# Altium project RS232 Communicate To TTL.PrjPcb
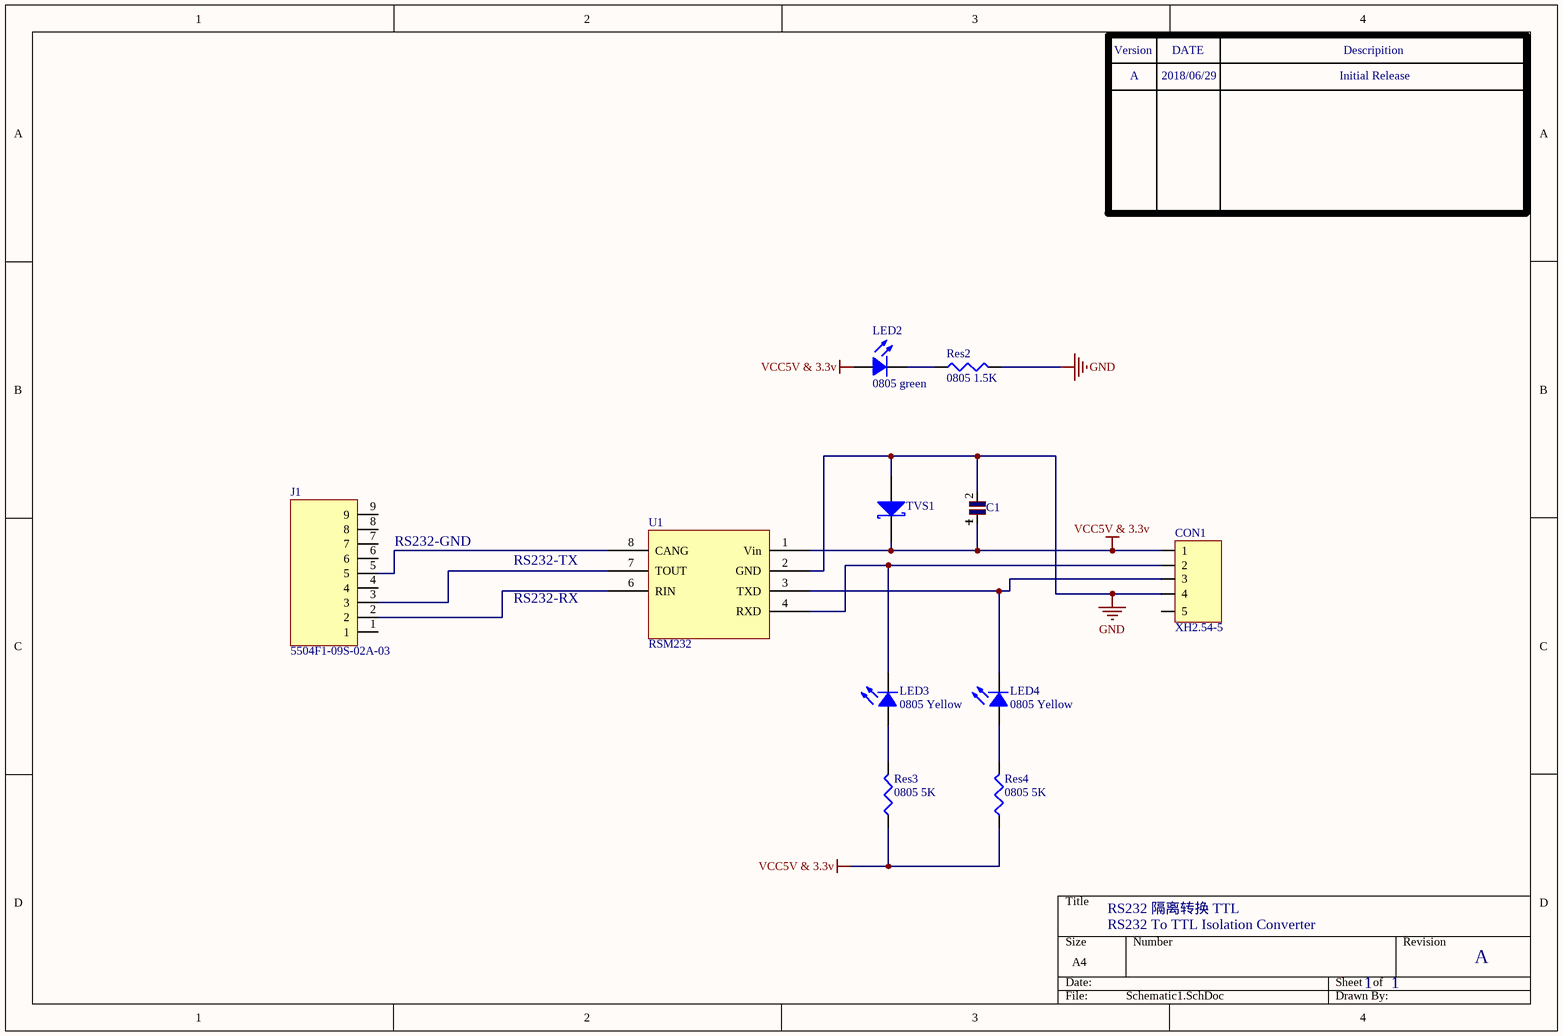
[diagram p0: Schematic1.SchDoc]
1 sheet, 11 parts. Net scope: global (net labels, ports and power ports of the same name join across sheets).
Board file: PCB1.PcbDoc

## Sheet Schematic1.SchDoc
size A4; Revision: A

### Parts
C1  T491C226K025AT  [T491C226K010AT]  (value not drawn)
CON1  XH2.54-5  [XH2.54-5]
J1  5504F1-09S-02A-03  [5504F1-09S-02A-03]
LED2  0805 green  [0805 LED]
LED3  0805 Yellow  [0805 LED]
LED4  0805 Yellow  [0805 LED]
Res2  0805 1.5K  [0805 Resistor]
Res3  0805 5K  [0805 Resistor]
Res4  0805 5K  [0805 Resistor]
TVS1  SMBJ5.0A  [SMBJ5.0A]  (value not drawn)
U1  RSM232  [RSM232]

### Nets
GND: C1.2 CON1.4 Res2.2 TVS1.1(A) U1.2(GND)
VCC5V & 3.3v: C1.1 CON1.1 LED2.1(A) Res3.1 Res4.1 TVS1.2(K) U1.1(Vin)
NetCON1_2: CON1.2 LED3.2(K) U1.4(RXD)
NetCON1_3: CON1.3 LED4.2(K) U1.3(TXD)
NetJ1_2: J1.2 U1.6(RIN)
NetJ1_3: J1.3 U1.7(TOUT)
NetJ1_5: J1.5 U1.8(CANG)
NetLED2_2: LED2.2(K) Res2.1
NetLED3_1: LED3.1(A) Res3.2
NetLED4_1: LED4.1(A) Res4.2

Not connected (* = marked no-connect by the designer): CON1 5; J1 1 4 6 7 8 9

### Notes on the sheet
- Version
- A
- 2018/06/29
- DATE
- Initial Release
- Descripition
- (near J1) RS232-GND
- RS232-TX
- RS232-RX
- RS232 隔离转换 TTL
- RS232 To TTL Isolation Converter
- 1

### Library data of the parts
C1 = T491C226K010AT: 表面贴装钽电容, 22 μF, 10 V, T491 系列, ± 10%, 2312 [6032 公
J1 = 5504F1-09S-02A-03: D-Sub 连接器, 9 触点, 插座, DE, AMPLIMITE HD-20系列, 金属主体, 焊接
LED2-LED4 = 0805 LED
Res2-Res4 = 0805 Resistor
TVS1 = SMBJ5.0A: ESD 抑制器/TVS 二极管